# EAGLE design 01 (EAGLE 8.3.2)
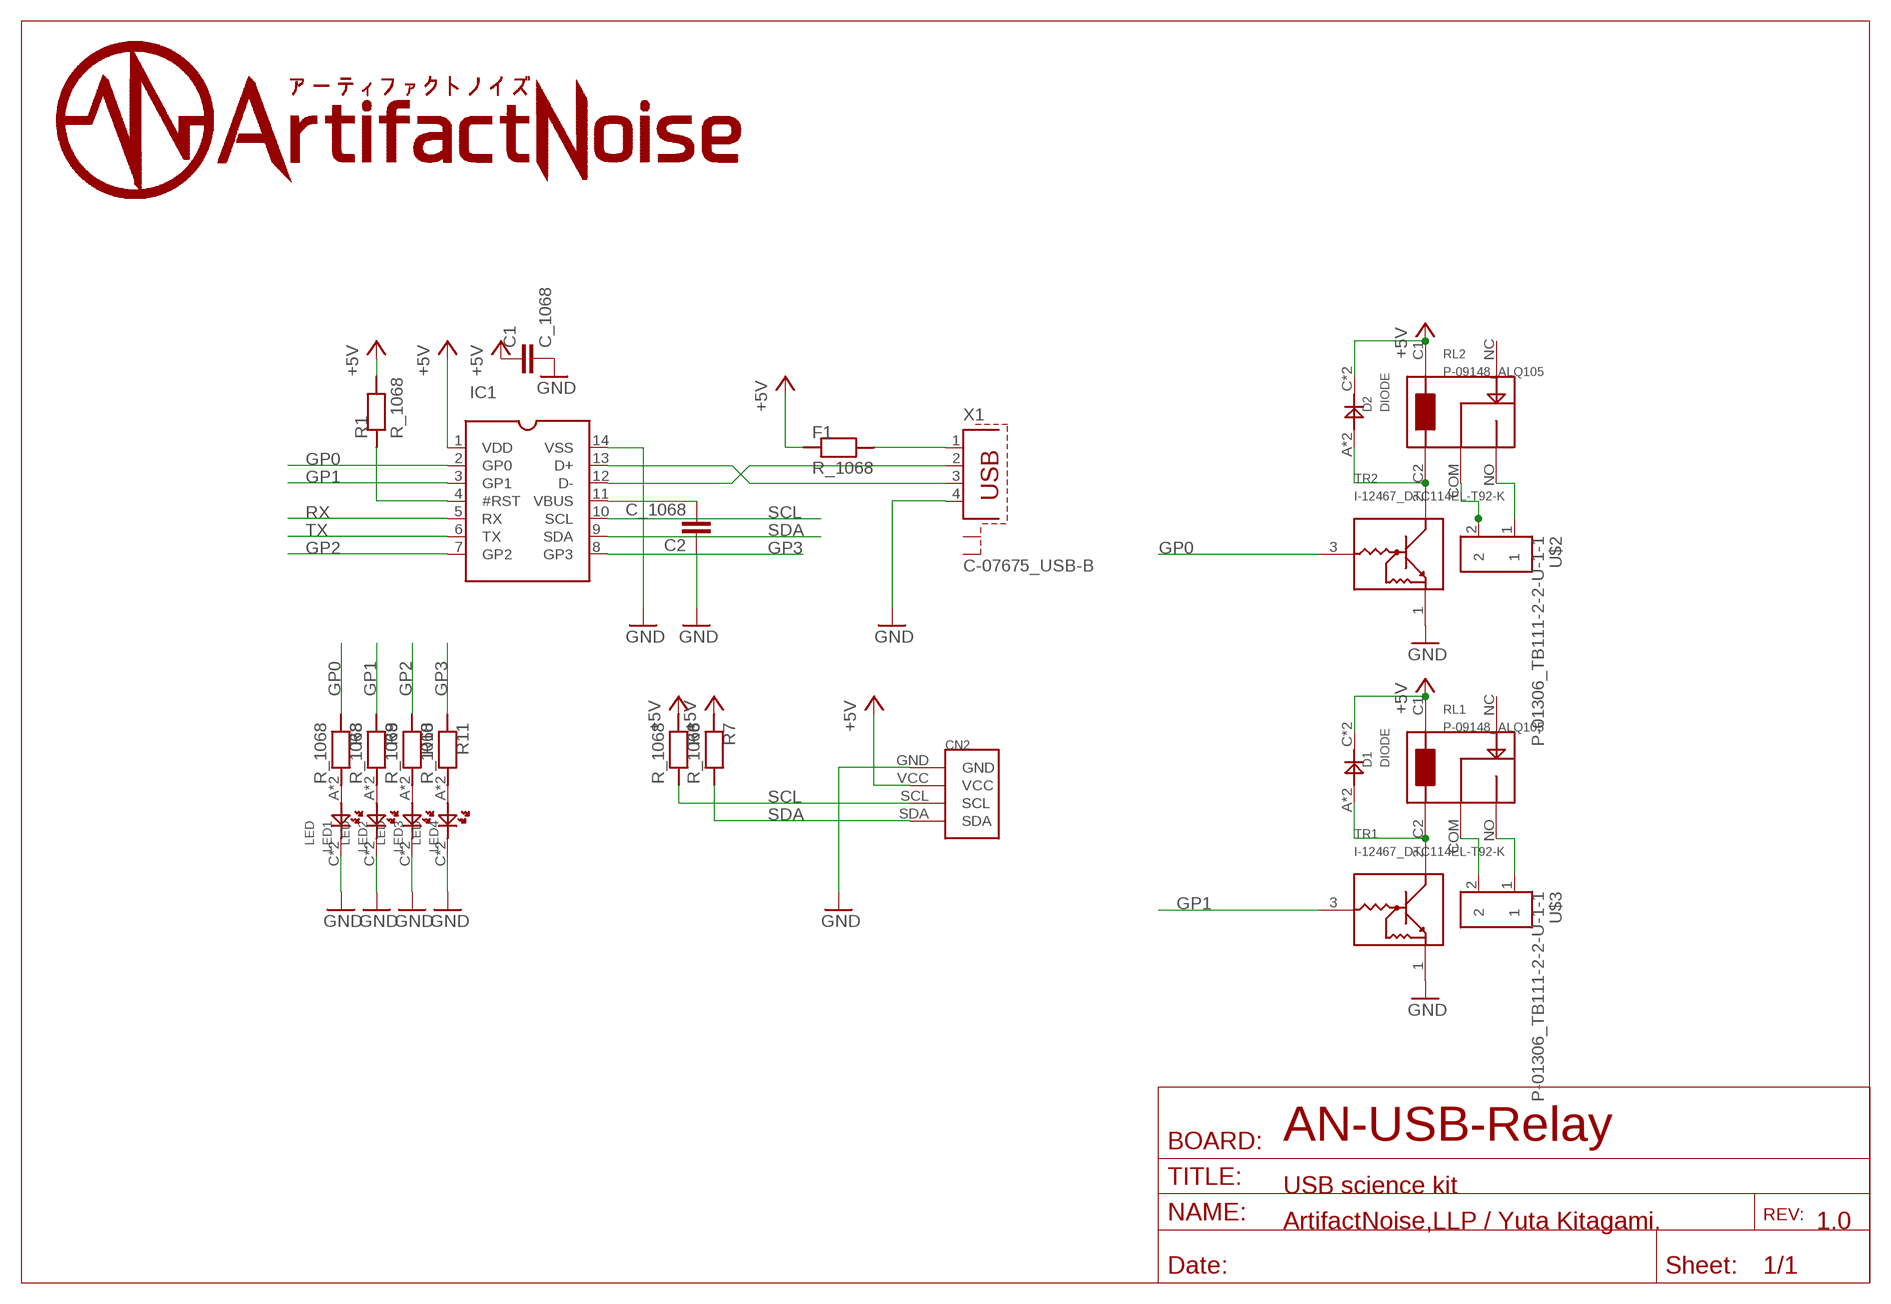
[diagram p0: schematic, sheet 1]

## Parts
C1  C_1068  [C0603]
C2  C_1068  [C0603]
CN2  PIN4  [PIN4]
D1  DIODE  [DIODE]
D2  DIODE  [DIODE]
F1  R_1068  [R0603]
IC1  _MCP2221A-I/PS  [SOCKET-14]
LED1  LED  [CHIPLED_0805]
LED2  LED  [CHIPLED_0805]
LED3  LED  [CHIPLED_0805]
LED4  LED  [CHIPLED_0805]
R1  R_1068  [R0603]
R6  R_1068  [R0603]
R7  R_1068  [R0603]
R8  R_1068  [R0603]
R9  R_1068  [R0603]
R10  R_1068  [R0603]
R11  R_1068  [R0603]
RL1  P-09148_ALQ105  [ALQ105]
RL2  P-09148_ALQ105  [ALQ105]
TR1  I-12467_DTC114EL-T92-K  [TO-92-AMMO]
TR2  I-12467_DTC114EL-T92-K  [TO-92-AMMO]
U$2  P-01306_TB111-2-2-U-1-1  [TB111-2-2-U-1-1]
U$3  P-01306_TB111-2-2-U-1-1  [TB111-2-2-U-1-1]
X1  C-07675_USB-B  [PN61729-S]

## Nets
+5V: C1.1 C1.D1 CN2.VCC D1.C D1.DC(C) D2.C D2.DC(C) F1.1 F1.D1 IC1.1(VDD) R1.2 R1.D2 R6.1 R6.D1 R7.1 R7.D1 RL1.C1 RL2.C1
GND: C1.2 C1.D2 C2.1 C2.D1 CN2.GND IC1.14(VSS) LED1.C LED1.DC(C) LED2.C LED2.DC(C) LED3.C LED3.DC(C) LED4.C LED4.DC(C) TR1.1(E) TR2.1(E) X1.4
GP0: IC1.2(GP0) R8.1 R8.D1 TR2.3(B)
GP1: IC1.3(GP1) R9.1 R9.D1 TR1.3(B)
GP2: IC1.7(GP2) R10.1 R10.D1
GP3: IC1.8(GP3) R11.1 R11.D1
N$1: IC1.4(#RST) R1.1 R1.D1
N$2: IC1.13(D+) X1.3
N$3: IC1.12(D-) X1.2
N$4: C2.2 C2.D2 IC1.11(VBUS)
N$5: F1.2 F1.D2 X1.1
N$6: D1.A D1.DA(A) RL1.C2 TR1.2(C)
N$8: RL2.COM U$2.2
N$9: LED1.A LED1.DA(A) R8.2 R8.D2
N$10: LED2.A LED2.DA(A) R9.2 R9.D2
N$11: LED3.A LED3.DA(A) R10.2 R10.D2
N$12: LED4.A LED4.DA(A) R11.2 R11.D2
N$13: RL2.NO U$2.1
N$14: RL1.COM U$3.2
N$15: RL1.NO U$3.1
N$17: D2.A D2.DA(A) RL2.C2 TR2.2(C)
RX: IC1.5(RX)
SCL: CN2.SCL IC1.10(SCL) R6.2 R6.D2
SDA: CN2.SDA IC1.9(SDA) R7.2 R7.D2
TX: IC1.6(TX)
Unconnected: RL1.NC RL2.NC X1.S1 X1.S2

## Notes on the sheet
- AN-USB-Relay
- USB science kit
- ArtifactNoise,LLP / Yuta Kitagami. | 1.0

## Library data of the parts
C1 C2 = 01:C_1068
CN2 = 01:PIN4
D1 D2 = 01:DIODE
F1 R1 R6-R11 = 01:R_1068
IC1 = 01:_MCP2221A-I/P: Dual In Line / Socket
LED1-LED4 = 01:LED
RL1 RL2 = 01:P-09148_ALQ105
TR1 TR2 = 01:I-12467_DTC114EL-T92-K
U$2 U$3 = Akizuki:P-01306_TB111-2-2-U-1-1
X1 = 01:C-07675_USB-B: BERG USB connector; OC_FARNELL: unknown; OC_NEWARK: unknown

## Board
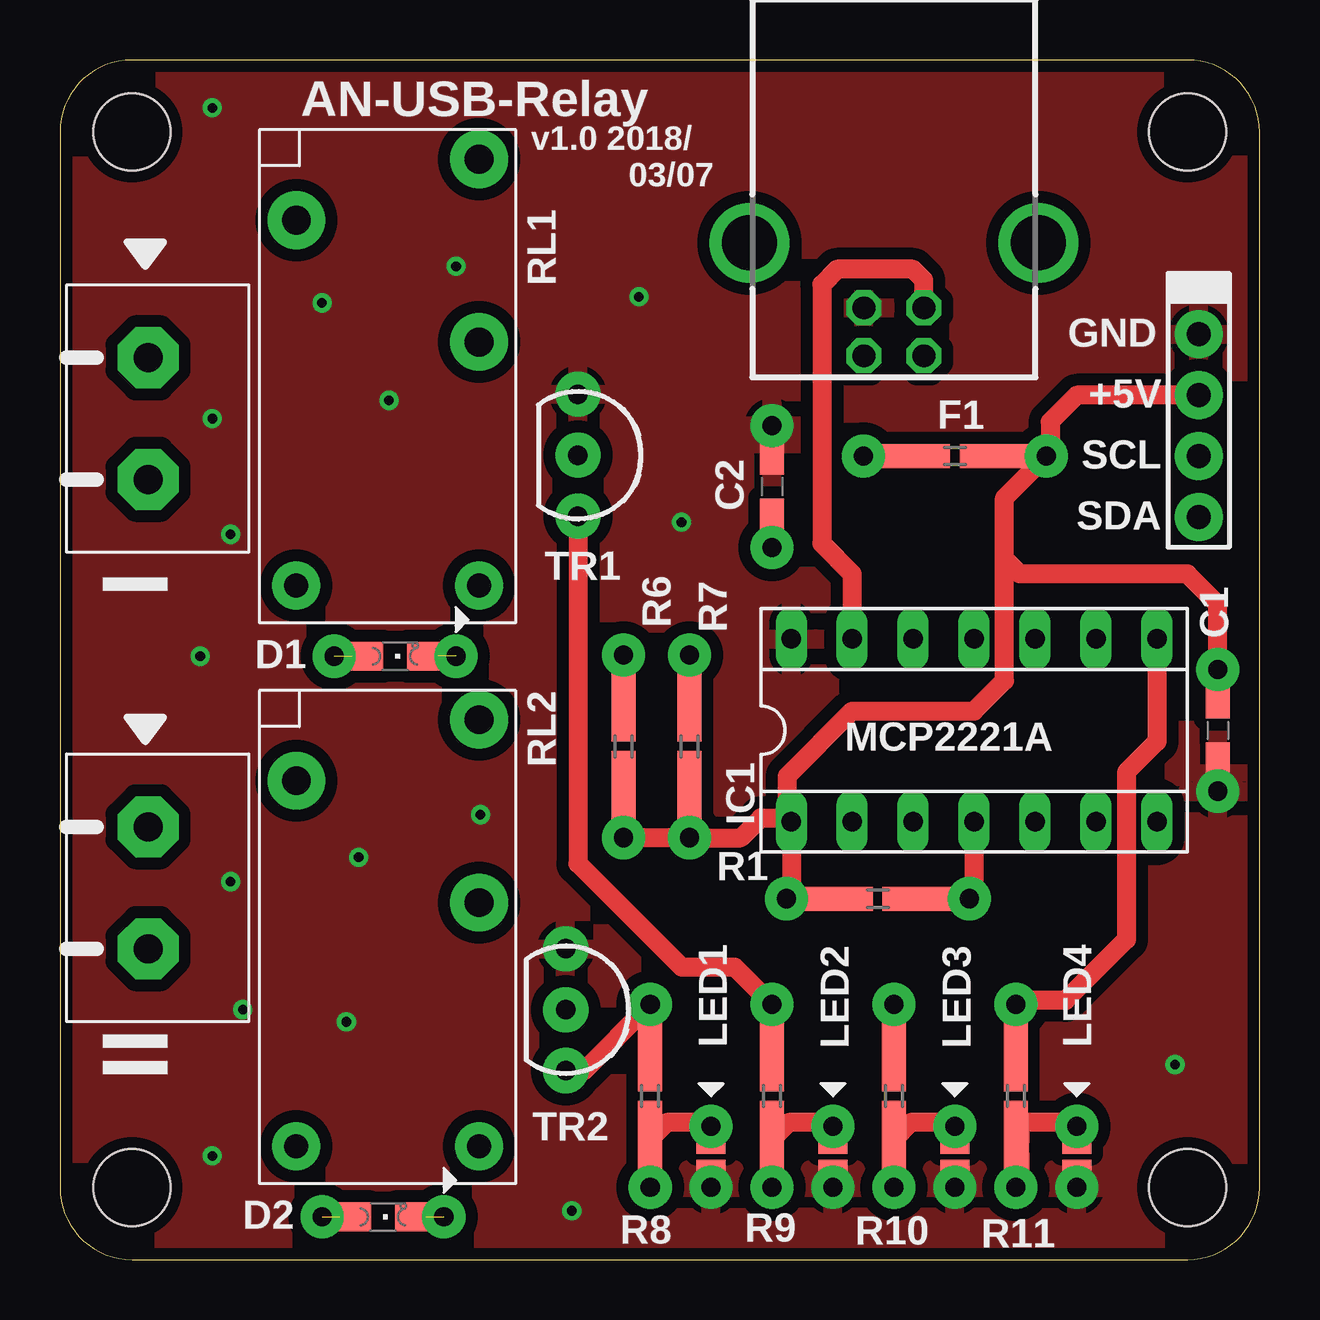
[diagram p1: board, top side]
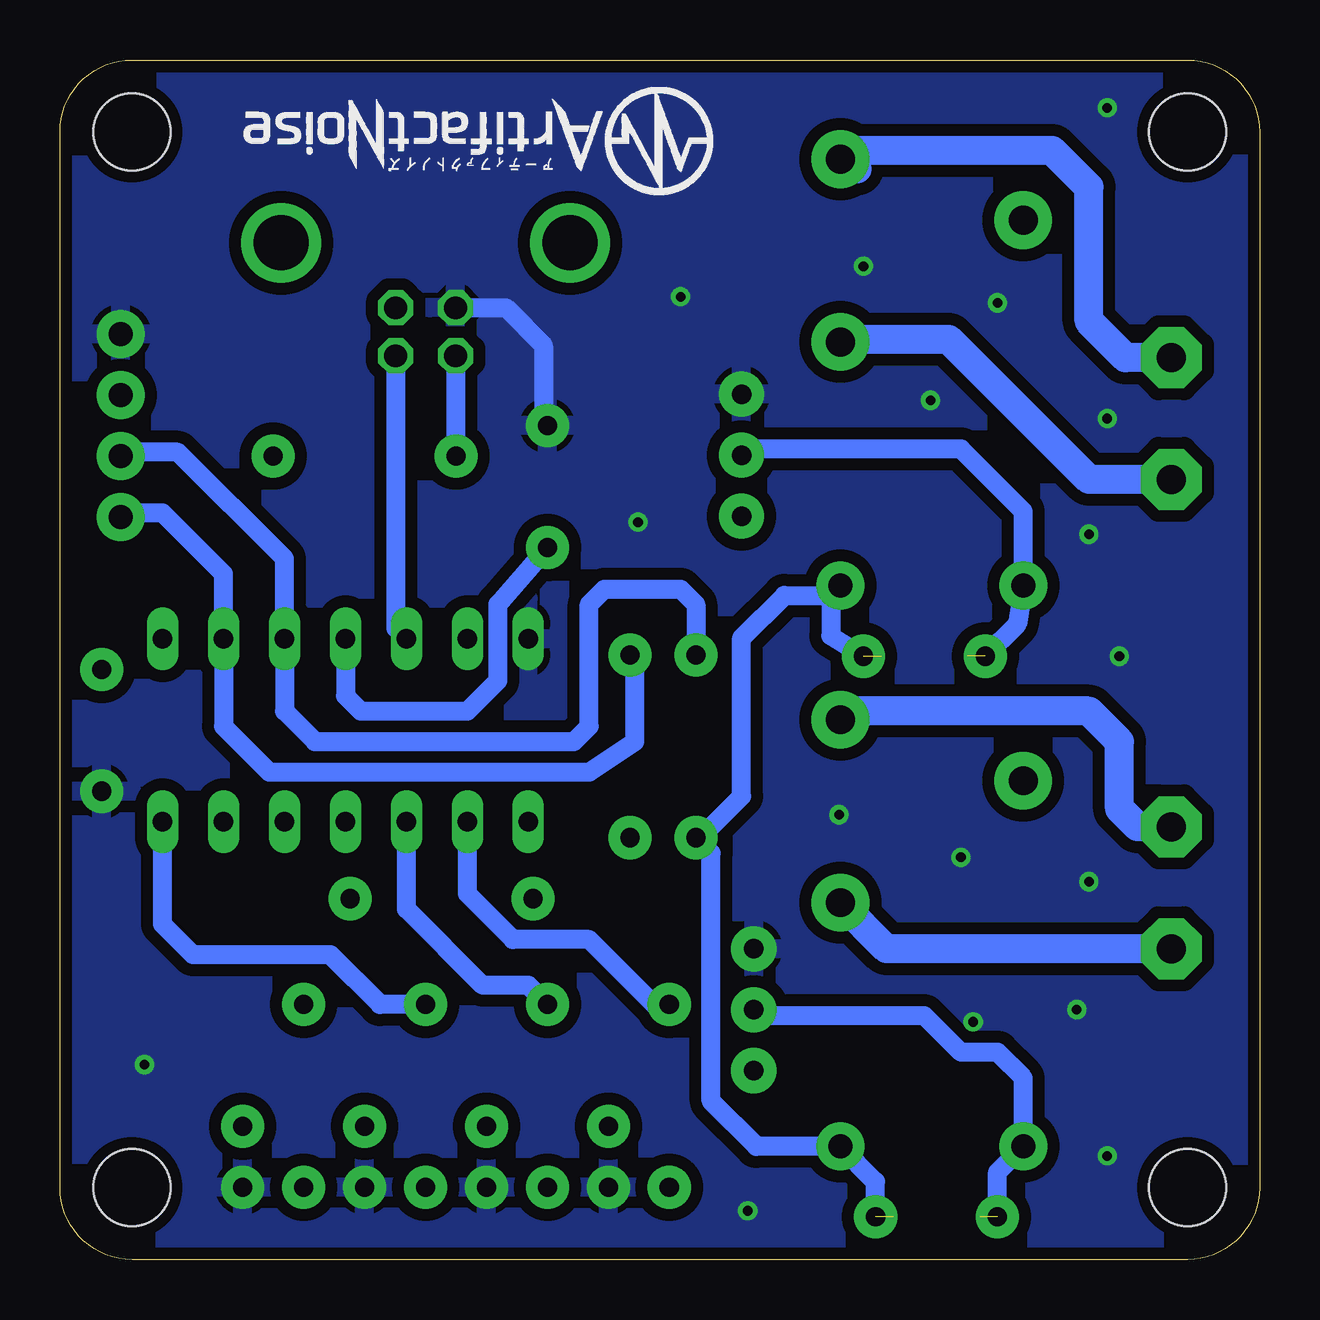
[diagram p2: board, bottom side, seen from below]

Size 50 x 50 mm. Coordinates in mm from the lower left corner, seen from the top.
Outline: 50,3 50,47 arc90 47,50 3,50 arc90 0,47 0,3 arc90 3,0 47,0 arc90 50,3
Copper layers (1*16): Top 0.035mm / dielectric 1.5mm / Bottom 0.035mm
Design rules "SeeedStudio_2layer_DRU_no_angle_20140221a": minimum track width 6mil, minimum drill 12mil, track to track 6mil, track to pad 6mil, pad to pad 6mil, via to via 6mil, smd to smd 0mil, copper to edge 10mil, drill to drill 10mil, minimum pad ring 10mil, minimum via ring 6mil, stop-mask expansion 2mil, vias tented up to drill 25mil, thermal gap 10mil
Holes 3.2 mm at 47,47 3,47 3,3 47,3

### Footprints (pad centres in the part's own frame; a part is rotated, then mirrored left to right if it is on the bottom)
C0603 = smd 2.6 x 1: 1 -1.8,0; 2 1.8,0 | drill 0.8 pad 1.8: D1 -2.54,0; D2 2.54,0
PIN4 = drill 1 pad 2: GND 0,-3.81; SCL 0,1.27; SDA 0,3.81; VCC 0,-1.27
DIODE = smd 1.2 x 2.6: A 0,-1.8; C 0,1.8 | drill 0.8 pad 1.8: DA 0,-2.54; DC 0,2.54
R0603 = smd 3.2 x 1: 1 -1.8,0; 2 1.8,0 | drill 0.8 pad 1.8: D1 -3.81,0; D2 3.81,0
SOCKET-14 = drill 0.813 long: 1 -7.62,-3.81; 2 -5.08,-3.81; 3 -2.54,-3.81; 4 0,-3.81; 5 2.54,-3.81; 6 5.08,-3.81; 7 7.62,-3.81; 8 7.62,3.81; 9 5.08,3.81; 10 2.54,3.81; 11 0,3.81; 12 -2.54,3.81; 13 -5.08,3.81; 14 -7.62,3.81
CHIPLED_0805 = smd 1.2 x 0.8: A 0,-1.8; C 0,-0.74 | drill 0.8 pad 1.8: DA 0,-2.54; DC 0,0
ALQ105 = drill 1 pad 2: C1 9,3.5; C2 9,-4.12 | drill 1.2 pad 2.4: COM -8.78,3.5; NC -6.24,-4.12; NO -1.16,3.5
TO-92-AMMO = drill 0.813 pad 1.88: 1 -2.54,0; 2 0,0; 3 2.54,0
TB111-2-2-U-1-1 = drill 1.2 pad 2.54 octagon: 1 0,4.2; 2 5.08,4.2
PN61729-S = drill 0.95 octagon: 1 1.25,4.71; 2 -1.25,4.71; 3 -1.25,2.71; 4 1.25,2.71 | drill 2.3 pad 2.9: S1 -6.02,0; S2 6.02,0

### Placement (x,y rotation side)
C1  48.26,22.06 270 top
C2  29.68,32.22 270 top
CN2  47.46,34.76 180 top
D1  13.97,25.15 270 top
D2  13.46,1.78 270 top
F1  37.3,33.49 180 top
IC1  38.1,22.06 0 top
LED1  27.14,3.01 180 top
LED2  32.22,3.01 180 top
LED3  37.3,3.01 180 top
LED4  42.38,3.01 180 top
R1  34.09,15.04 180 top
R6  23.5,21.39 90 top
R7  26.23,21.39 90 top
R8  24.6,6.82 270 top
R9  29.68,6.82 270 top
R10  34.76,6.82 270 top
R11  39.84,6.82 270 top
RL1  13.97,37.08 270 top
RL2  13.97,13.72 270 top
TR1  21.59,33.53 270 top
TR2  21.08,10.41 270 top
U$1  [AN-LOGO2]  22.79,48.87 180 bottom
U$2  7.87,12.95 90 top
U$3  7.87,32.51 90 top
X1  34.76,42.38 180 top

### Tracks (layer width: path | path; a pad name or v marks a point on that pad's centre or on a via)
+5V  (2 unrouted)
  Top 0.406: R6.1 R6.D1 | R7.1 R7.D1 | R1.2 R1.D2
  Top 0.8: F1.1 F1.D1 | CN2.VCC 42.38,36.03 41.27,34.92 41.27,33.66 F1.D1 | R1.D2 30.48,15.24 IC1.1 30.32,18.41 | 30.32,18.41 29.21,18.41 28.38,17.58 R7.D1 R6.D1 23.44,17.53 | C1.1 C1.D1 48.26,27.3 46.99,28.57 40.01,28.57 39.37,29.21 | 30.32,18.41 30.32,20.16 33.02,22.86 38.1,22.86 39.37,24.13 39.37,29.21 | 39.37,29.21 39.37,31.75 F1.D1
  Bottom 0.8: 17.87,27.69 19.81,27.69 21.59,25.91 21.59,19.3 23.31,17.58 R6.D1 22.86,16.95 22.86,6.6 20.97,4.72 RL2.C1 16,3.25 D2.DC | 17.87,27.69 RL1.C1 | 17.87,27.69 17.87,26 D1.DC
GND  (via drill 0.4 pad 0.8)
  Top 0.8: LED4.C LED4.DC
  Bottom 0.8: X1.4 31.41,39.67 29.84,38.1 29.84,34.92 C2.D1
  other vias: 21.34,2.03 7.11,15.75 6.35,35.05 16.51,41.4 13.72,35.81 6.35,48.01 10.92,39.88 7.11,30.23 17.53,18.54 7.62,10.41 11.94,9.91 5.84,25.15 12.45,16.76 24.13,40.13 6.35,4.32 46.48,8.13 25.91,30.73
  pour Top (isolate 0.5): 51.27,-0.8 -0.8,-0.8 -0.8,51.27 51.27,51.27
  pour Bottom (isolate 0.5): 51.27,-0.8 -0.8,-0.8 -0.8,51.27 51.27,51.27
GP0
  Top 0.406: R8.1 R8.D1
  Top 0.8: TR2.3 21.84,7.87 R8.D1
  Bottom 0.8: R8.D1 25.23,10.63 27.94,13.34 31.11,13.34 33.02,15.24 IC1.2
GP1
  Top 0.406: R9.1 R9.D1
  Top 0.8: TR1.3 21.59,16.51 25.91,12.19 28.12,12.19 R9.D1
  Bottom 0.8: R9.D1 30.48,11.43 32.38,11.43 35.56,14.61 IC1.3
GP2
  Top 0.406: R10.1 R10.D1
  Bottom 0.8: R10.D1 36.66,10.63 38.73,12.7 44.45,12.7 45.72,13.97 IC1.7
GP3
  Top 0.406: R11.1 R11.D1
  Top 0.8: IC1.8 45.72,21.59 44.45,20.32 44.45,13.34 41.91,10.79 40.01,10.79 R11.D1
N$1
  Top 0.406: R1.1 R1.D1
  Top 0.8: IC1.4 38.1,15.24 R1.D1
N$2
  Top 0.8: X1.3 36.01,40.83 35.56,41.27 32.38,41.27 31.75,40.64 31.75,29.84 33.02,28.57 IC1.13
N$3
  Bottom 0.8: X1.2 36.01,26.32 IC1.12
N$4
  Top 0.406: C2.D2 C2.2
  Bottom 0.8: IC1.11 38.1,23.5 37.47,22.86 33.02,22.86 31.75,24.13 31.75,27.3 C2.D2
N$5
  Top 0.8: F1.D2 F1.2
  Bottom 0.8: X1.1 33.51,33.51 F1.D2
N$6  (1 unrouted)
  Bottom 0.8: TR1.2 21.34,33.78 12.45,33.78 9.85,31.19 RL1.C2 10.1,26.47 D1.DA
N$8
  Bottom 1.2: U$2.2 5.08,18.03 5.84,18.8 5.84,21.59 7.11,22.86 17.11,22.86 RL2.COM
N$9
  Top 0.8: LED1.A LED1.DA 27.3,5.71 25.3,5.71 R8.2 R8.D2
N$10
  Top 0.8: LED2.A LED2.DA 32.38,5.71 30.38,5.71 R9.2 R9.D2
N$11
  Top 0.8: LED3.A LED3.DA 37.47,5.71 35.45,5.71 R10.2 34.76,3.98 34.92,3.17 R10.D2
N$12
  Top 0.8: LED4.A LED4.DA 42.55,5.71 40.01,5.71 40.01,4.86 | R11.D2 40.01,3.17 40.01,4.45 40.01,4.86 | 40.01,4.86 R11.2
N$13
  Bottom 1.2: U$2.1 15.55,12.95 RL2.NO
N$14
  Bottom 1.2: 16.76,45.47 17.58,45.47 RL1.COM 17.11,46.23 8.64,46.23 7.11,44.7 7.11,39.12 5.59,37.59 U$3.2
N$15
  Bottom 1.2: U$3.1 7.11,32.51 12.95,38.35 17.36,38.35 RL1.NO
N$17  (1 unrouted)
  Bottom 0.8: TR2.2 20.83,10.16 13.97,10.16 12.45,8.64 10.92,8.64 9.85,7.56 RL2.C2 10.92,3.64 D2.DA
SCL
  Top 0.406: R6.2 R6.D2
  Bottom 0.8: R6.D2 23.5,27.3 24.13,27.94 27.3,27.94 27.94,27.3 27.94,22.23 28.57,21.59 39.37,21.59 40.64,22.86 IC1.10 40.64,29.21 45.09,33.66 47.3,33.66 CN2.SCL
SDA
  Top 0.406: R7.2 R7.D2
  Bottom 0.8: CN2.SDA 47.3,31.11 45.72,31.11 43.18,28.57 IC1.9 43.18,22.23 41.27,20.32 27.94,20.32 26.04,21.59 26.04,25 R7.D2

### Text on the board
tPlace: AN-USB-Relay | v1.0 2018/ | 03/07 | GND | +5V | SCL | SDA | I | MCP2221A | II